# Altium schematic sheet 09_MIPI_LCD_TX1.SchDoc
size 297 x 209 mm
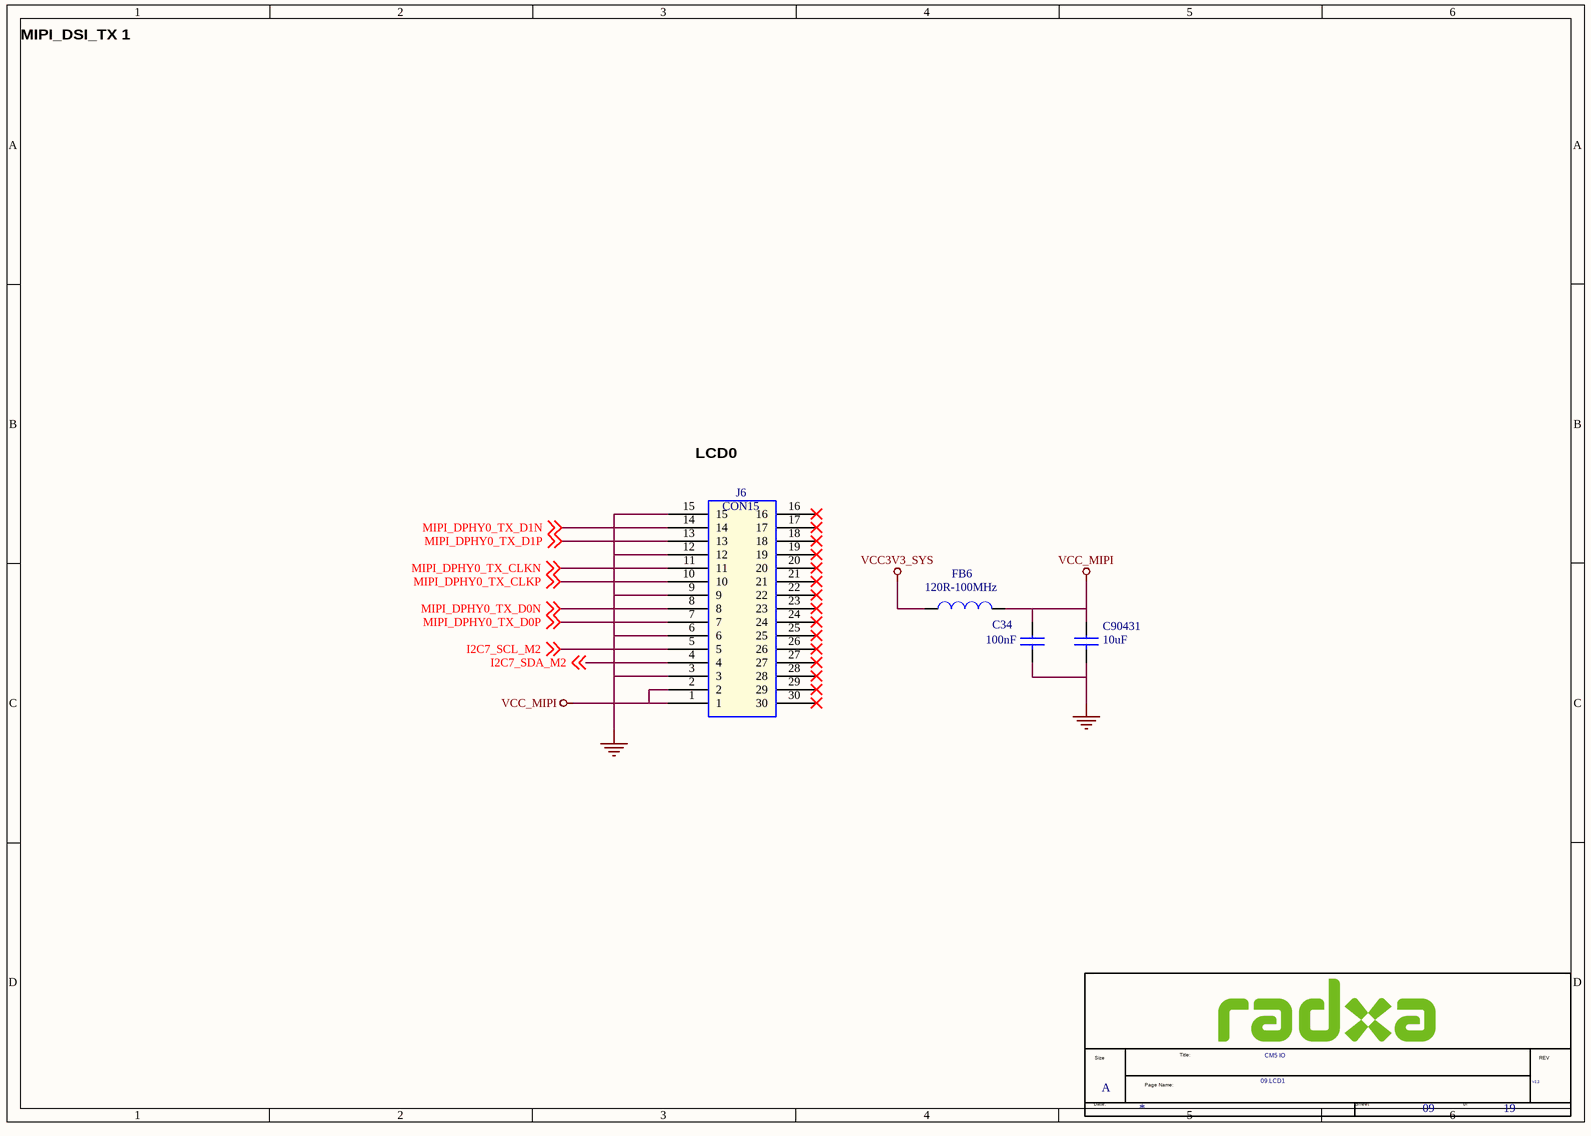
[diagram p0: 09_MIPI_LCD_TX1.SchDoc]

## Parts
*  Doc: 09.LCD1  RevCode: V2.2  Title: CM5 IO  Page Size: A  Page Number: 09  Page Count: 19  (hidden comment: radxa_1010)  (graphical)
C34  100nF  [C0402]
C90431  10uF  [C0603]
FB6  120R-100MHz  [L0402]
J6  CON15  [FPC15PIN-1.0MM-LS]

## Nets
GND: C34.2 C90431.2 J6.3 J6.6 J6.9 J6.12 J6.15
VCC3V3_SYS: FB6.1
VCC_MIPI: C34.1 C90431.1 FB6.2 J6.1 J6.2
I2C7_SCL_M2: J6.5 ; off-sheet I2C7_SCL_M2
I2C7_SDA_M2: J6.4 ; off-sheet I2C7_SDA_M2
MIPI_DPHY0_TX_CLKN: J6.11 ; off-sheet MIPI_DPHY0_TX_CLKN
MIPI_DPHY0_TX_CLKP: J6.10 ; off-sheet MIPI_DPHY0_TX_CLKP
MIPI_DPHY0_TX_D0N: J6.8 ; off-sheet MIPI_DPHY0_TX_D0N
MIPI_DPHY0_TX_D0P: J6.7 ; off-sheet MIPI_DPHY0_TX_D0P
MIPI_DPHY0_TX_D1N: J6.14 ; off-sheet MIPI_DPHY0_TX_D1N
MIPI_DPHY0_TX_D1P: J6.13 ; off-sheet MIPI_DPHY0_TX_D1P

Not connected (* = marked no-connect by the designer): J6 16* 17* 18* 19* 20* 21* 22* 23* 24* 25* 26* 27* 28* 29* 30*

## Notes on the sheet
- MIPI_DSI_TX 1
- (near J6) LCD0
- (in symbol radxa_1010) Size; Title:; REV; Page Name:; Date:; Sheet; of

## Library data of the parts
C34 = CAP NP_0_Dup4: cap,100.00nF,+/-10%,16V,X5R,C0402; Manufacturer PN: C1005X5R1C104K050BA; Manufacturer: TDK; Tolerance: 10%; Priority: A; Voltage: 16V; PCB Footprint: C0402; Dielectric: X5R; Created by: JJJ; Part Type: C0402; RK PN: C1005X5R1C104K050BA
C90431 = CAP NP_0_Dup3: cap,10.00uF,+/-10%,10V,X5R,C0805; Manufacturer PN: C2012X5R1A106K125AB; Manufacturer: TDK; Tolerance: 10%; Priority: A; Dielectric: X5R; PCB Footprint: C0603; Voltage: 10V; Created by: JJJ; Part Type: C0805; RK PN: C2012X5R1A106K125AB
FB6 = BEAD_0: BEAD,120R@100MHz,current=2000mA,0603; Manufacturer: Murata; Tolerance: 25%; Irms: 2A; DC Resistor: 0.030ohm; RK PN: BLM18KG121TN1; Priority: L; PCB Footprint: L0402; Part Type: BEAD; Manufacturer PN: BLM18KG121TN1; Created by: DZS
J6 = CON15_4: PCB Footprint: FPC15PIN-1.0MM-LS
* = radxa_1010: Page Create Date: March  8, 1995; Page Modify Date: *